# Altium schematic sheet solarchicken.SchDoc
size A3
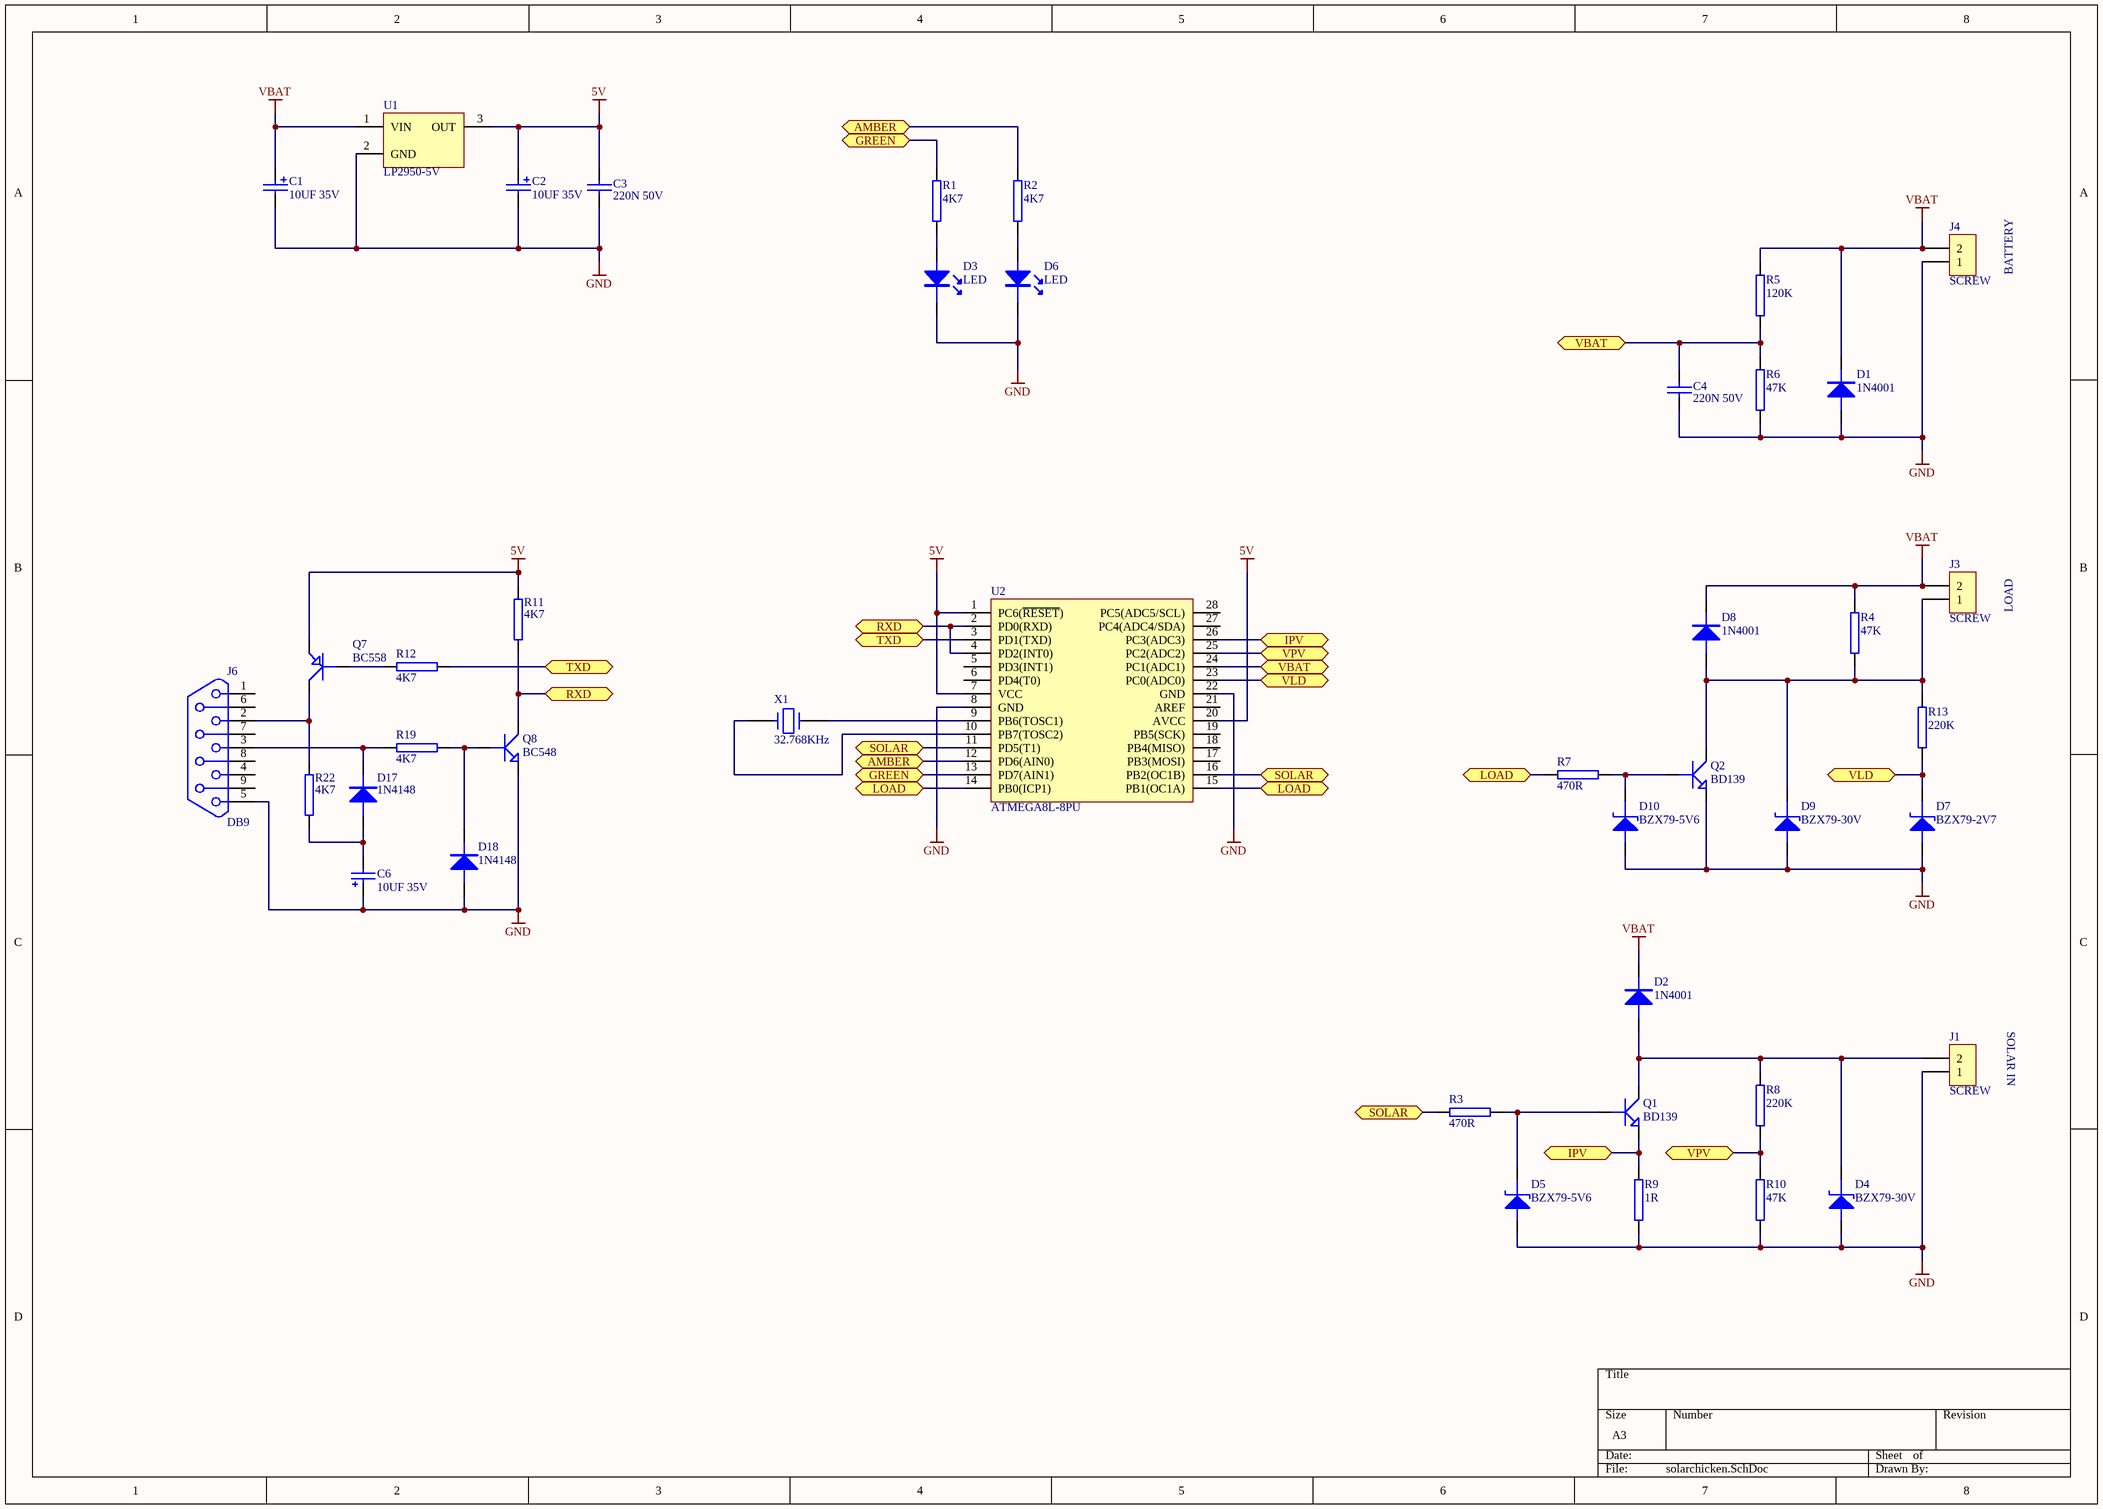
[diagram p0: solarchicken.SchDoc]

## Parts
C1  10UF 35V  [RADIAL01P]
C2  10UF 35V  [RADIAL01P]
C3  220N 50V  [RAD02]
C4  220N 50V  [RAD02]
C6  10UF 35V  [RADIAL01P]
D1  1N4001  [DO35S]
D2  1N4001  [DO35S]
D3  LED  [LED3MM]
D4  BZX79-30V  [DO35S]
D5  BZX79-5V6  [DO35S]
D6  LED  [LED3MM]
D7  BZX79-2V7  [DO35S]
D8  1N4001  [DO35S]
D9  BZX79-30V  [DO35S]
D10  BZX79-5V6  [DO35S]
D17  1N4148  [DO35S]
D18  1N4148  [DO35S]
J1  SCREW  [MKD500S2]
J3  SCREW  [MKD500S2]
J4  SCREW  [MKD500S2]
J6  DB9  [DB9S]
Q1  BD139  [TO220V]
Q2  BD139  [TO220V]
Q7  BC558  [TO92]
Q8  BC548  [TO92]
R1  4K7  [AXIAL04]
R2  4K7  [AXIAL04]
R3  470R  [AXIAL04]
R4  47K  [AXIAL04]
R5  120K  [AXIAL04]
R6  47K  [AXIAL04]
R7  470R  [AXIAL04]
R8  220K  [AXIAL04]
R9  1R  [AXIAL04]
R10  47K  [AXIAL04]
R11  4K7  [AXIAL04]
R12  4K7  [AXIAL04]
R13  220K  [AXIAL04]
R19  4K7  [AXIAL04]
R22  4K7  [AXIAL04]
U1  LP2950-5V  [TO92]
U2  ATMEGA8L-8PU  [DIP28N]
X1  32.768KHz  [RADIAL01]

## Ports
AMBER, GREEN, IPV, LOAD, RXD, SOLAR, TXD, VBAT, VLD, VPV

## Nets
5V: C2.1 C3.1 Q7.1(E) R11.2 U1.3(OUT) U2.1(PC6(~{RESET})) U2.7(VCC) U2.20(AVCC)
GND: C1.2 C2.2 C3.2 C4.2 C6.1 D1.1(A) D3.2(K) D4.1(A) D5.1(A) D6.2(K) D7.1(A) D9.1(A) D10.1(A) D18.1(A) J1.1 J4.1 J6.5 Q2.1(E) Q8.1(E) R6.2 R9.2 R10.2 U1.2(GND) U2.8(GND) U2.22(GND)
VBAT: C1.1 D1.2(K) D2.2(K) D8.2(K) J3.2 J4.2 R4.1 R5.1 U1.1(VIN)
AMBER: R2.1 U2.12(PD6(AIN0)) ; port AMBER
GREEN: R1.1 U2.13(PD7(AIN1)) ; port GREEN
IPV: Q1.1(E) R9.1 U2.26(PC3(ADC3)) ; port IPV
LOAD: R7.2 U2.14(PB0(ICP1)) U2.15(PB1(OC1A)) ; port LOAD
RXD: Q8.3(C) R11.1 U2.2(PD0(RXD)) U2.4(PD2(INT0)) ; port RXD
SOLAR: R3.2 U2.11(PD5(T1)) U2.16(PB2(OC1B)) ; port SOLAR
TXD: R12.1 U2.3(PD1(TXD)) ; port TXD
VBAT: C4.1 R5.2 R6.1 U2.24(PC1(ADC1)) ; port VBAT  [a separate net that carries the same name]
VLD: D7.2(K) R13.2 U2.23(PC0(ADC0)) ; port VLD
VPV: R8.2 R10.1 U2.25(PC2(ADC2)) ; port VPV
NetC6_2: C6.2 D17.1(A) R22.1
NetD2_1: D2.1(A) D4.2(K) J1.2 Q1.2(C) R8.1
NetD3_1: D3.1(A) R1.2
NetD5_2: D5.2(K) Q1.3(B) R3.1
NetD6_1: D6.1(A) R2.2
NetD8_1: D8.1(A) D9.2(K) J3.1 Q2.2(C) R4.2 R13.1
NetD10_2: D10.2(K) Q2.3(B) R7.1
NetD17_2: D17.2(K) J6.3 R19.2
NetD18_2: D18.2(K) Q8.2(B) R19.1
NetJ6_2: J6.2 Q7.3(C) R22.2
NetQ7_2: Q7.2(B) R12.2
NetU2_9: U2.9(PB6(TOSC1)) X1.1
NetU2_10: U2.10(PB7(TOSC2)) X1.2

Not connected (* = marked no-connect by the designer): J6 1 4 6 7 8 9; U2 5(PD3(INT1)) 6(PD4(T0)) 17(PB3(MOSI)) 18(PB4(MISO)) 19(PB5(SCK)) 21(AREF) 27(PC4(ADC4/SDA)) 28(PC5(ADC5/SCL))

## Notes on the sheet
- BATTERY
- LOAD
- SOLAR IN

## Library data of the parts
C1 C2 C6 = CAPPOL: CAPACITOR ELECTROLYTIC
C3 C4 = CAPACITOR
D4 D5 D7 D9 D10 = BZX79: ZENER DIODE
D17 D18 = 1N4001
J1 J3 = CON2: CONNECTOR; Text Field1: 2 PIN 2.54MM PITCH SINGLE
J4 = CON2: CONNECTOR
J6 = DB9: CONNECTOR; Text Field1: DB9 FEM 90 DEG
R1-R13 R19 R22 = RES: RESISTOR
U1 = LP2950
U2 = ATMEGA8L-8PU: MICROCONTROLLER
X1 = XTAL: CRYSTAL